# Altium project gpr.PrjPCB
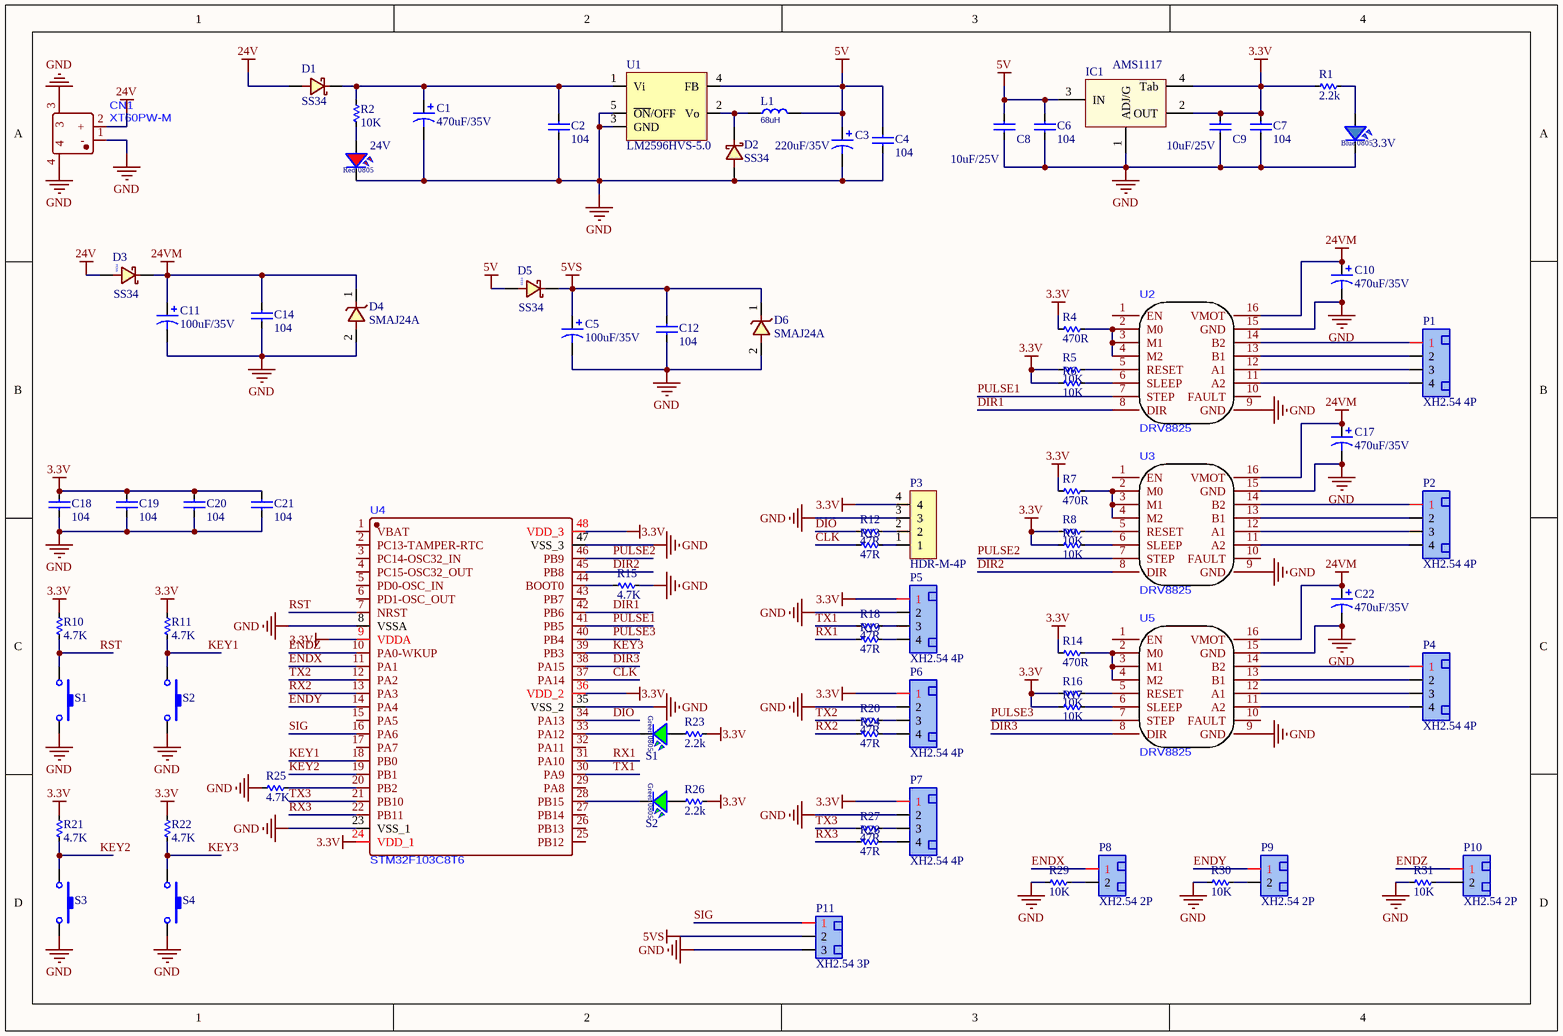
[diagram p0: schematic.SchDoc]
1 sheet, 82 parts. Net scope: global (net labels, ports and power ports of the same name join across sheets).
Board file: pcb.PcbDoc

## Sheet schematic.SchDoc: <Project Name>
size A4; ENG_APP_DATE: --/--/--; DSN_APP_DATE: --/--/--; CHK_APP_DATE: --/--/--; Engineer: Engineer; Address4: Thành phố Hồ Chí Minh; DocumentNumber: 1; Revision: 1.0; SheetNumber: 1; SheetTotal: 1

### Parts
(Parts that share a designator on the sheet are numbered #1, #2 ... from top to bottom, then left to right.)
3.3V  LED BLUE  [LED 0805 Blue]  (value not drawn)
24V  LED RED  [LED 0805 Red]  (value not drawn)
C1  470uF/35V  [C8X12mm]
C2  104  [C_0805_SMD]
C3  220uF/35V  [C8X12mm]
C4  104  [C_0805_SMD]
C5  100uF/35V  [C_6.3x12]
C6  104  [C_0805_SMD]
C7  104  [C_0805_SMD]
C8  10uF/25V  [C_0805_SMD]
C9  10uF/25V  [C_0805_SMD]
C10  470uF/35V  [C8X12mm]
C11  100uF/35V  [C_6.3x12]
C12  104  [C_0805_SMD]
C14  104  [C_0805_SMD]
C17  470uF/35V  [C8X12mm]
C18  104  [C_0805_SMD]
C19  104  [C_0805_SMD]
C20  104  [C_0805_SMD]
C21  104  [C_0805_SMD]
C22  470uF/35V  [C8X12mm]
CN1  XT60PW-M  [CONN-TH_XT60PW-M]
D1  SS34  [D_SMA]
D2  SS34  [D_SMA]
D3  SS34  [D_SMA]
D4  SMAJ24A  [DO_241AC_SMA_MFG]
D5  SS34  [D_SMA]
D6  SMAJ24A  [DO_241AC_SMA_MFG]
IC1  AMS1117  [SOT223-4N]
L1  68uH  [CDRH127]
P1  XH2.54 4P  [XH2.54_4P_RA]
P2  XH2.54 4P  [XH2.54_4P_RA]
P3  HDR-M-4P  [HDR_M_1X4]
P4  XH2.54 4P  [XH2.54_4P_RA]
P5  XH2.54 4P  [XH2.54_4P_RA]
P6  XH2.54 4P  [XH2.54_4P_RA]
P7  XH2.54 4P  [XH2.54_4P_RA]
P8  XH2.54 2P  [XH2.54_2P_RA]
P9  XH2.54 2P  [XH2.54_2P_RA]
P10  XH2.54 2P  [XH2.54_2P_RA]
P11  XH2.54 3P  [XH2.54_3P_RA]
R1  2.2k  [RES-SMD-0805]
R2  10K  [RES-SMD-0805]
R4  470R  [RES-SMD-0805]
R5  10K  [RES-SMD-0805]
R6  10K  [RES-SMD-0805]
R7  470R  [RES-SMD-0805]
R8  10K  [RES-SMD-0805]
R9  10K  [RES-SMD-0805]
R10  4.7K  [RES-SMD-0805]
R11  4.7K  [RES-SMD-0805]
R12  47R  [RES-SMD-0805]
R13  47R  [RES-SMD-0805]
R14  470R  [RES-SMD-0805]
R15  4.7K  [RES-SMD-0805]
R16  10K  [RES-SMD-0805]
R17  10K  [RES-SMD-0805]
R18  47R  [RES-SMD-0805]
R19  47R  [RES-SMD-0805]
R20  47R  [RES-SMD-0805]
R21  4.7K  [RES-SMD-0805]
R22  4.7K  [RES-SMD-0805]
R23  2.2k  [RES-SMD-0805]
R24  47R  [RES-SMD-0805]
R25  4.7K  [RES-SMD-0805]
R26  2.2k  [RES-SMD-0805]
R27  47R  [RES-SMD-0805]
R28  47R  [RES-SMD-0805]
R29  10K  [RES-SMD-0805]
R30  10K  [RES-SMD-0805]
R31  10K  [RES-SMD-0805]
S1#1  SW-SMD  [SW-SMD 3x6 mm]  (value not drawn)
S1#2  LED GREEN  [LED 0805 Green]  (value not drawn)
S2#1  SW-SMD  [SW-SMD 3x6 mm]  (value not drawn)
S2#2  LED GREEN  [LED 0805 Green]  (value not drawn)
S3  SW-SMD  [SW-SMD 3x6 mm]  (value not drawn)
S4  SW-SMD  [SW-SMD 3x6 mm]  (value not drawn)
U1  LM2596HVS-5.0  [TO-263-5]
U2  DRV8825  [DRV8825]
U3  DRV8825  [DRV8825]
U4  STM32F103C8T6  [LQFP-48_L7.0-W7.0-P0.50-LS9.0-BL]
U5  DRV8825  [DRV8825]

### Nets
3.3V: C7.2 C9.2 C18.2 C19.2 C20.2 C21.2 IC1.2(OUT) IC1.4(Tab) P3.4 P5.1 P6.1 P7.1 R1.2 R4.2 R5.2 R6.2 R7.2 R8.2 R9.2 R10.1 R11.1 R14.2 R16.2 R17.2 R21.1 R22.1 R23.1 R26.1 U4.9(VDDA) U4.24(VDD_1) U4.36(VDD_2) U4.48(VDD_3)
5V: C3.1 C4.2 C6.2 C8.2 D5.1(A) IC1.3(IN) L1.2 U1.4(FB)
5VS: C5.1 C12.1 D5.2(K) D6.1 P11.2
24V: CN1.2(+) D1.1(A) D3.1(A)
24VM: C10.1 C11.1 C14.1 C17.1 C22.1 D3.2(K) D4.1 U2.16(VMOT) U3.16(VMOT) U5.16(VMOT)
GND: 3.3V.2 24V.2 C1.2 C2.1 C3.2 C4.1 C5.2 C6.1 C7.1 C8.1 C9.1 C10.2 C11.2 C12.2 C14.2 C17.2 C18.1 C19.1 C20.1 C21.1 C22.2 CN1.1(-) CN1.3 CN1.4 D2.1(A) D4.2 D6.2 IC1.1(ADJ/G) P3.3 P5.2 P6.2 P7.2 P11.3 R15.1 R25.1 R29.2 R30.2 R31.2 S1#1.2 S2#1.2 S3.2 S4.2 U1.3(GND) U1.5(~{ON}/OFF) U2.9(GND) U2.15(GND) U3.9(GND) U3.15(GND) U4.8(VSSA) U4.23(VSS_1) U4.35(VSS_2) U4.47(VSS_3) U5.9(GND) U5.15(GND)
CLK: R13.2 U4.37(PA14)
DIO: R12.2 U4.34(PA13)
DIR1: U2.8(DIR) U4.42(PB6)
DIR2: U3.8(DIR) U4.45(PB8)
DIR3: U4.38(PA15) U5.8(DIR)
ENDX: P8.1 U4.11(PA1)
ENDY: P9.1 U4.14(PA4)
ENDZ: P10.1 U4.10(PA0-WKUP)
KEY1: R11.2 S2#1.1 U4.18(PB0)
KEY2: R21.2 S3.1 U4.19(PB1)
KEY3: R22.2 S4.1 U4.39(PB3)
PULSE1: U2.7(STEP) U4.41(PB5)
PULSE2: U3.7(STEP) U4.46(PB9)
PULSE3: U4.40(PB4) U5.7(STEP)
RST: R10.2 S1#1.1 U4.7(NRST)
RX1: R19.2 U4.31(PA10)
RX2: R24.2 U4.13(PA3)
RX3: R28.2 U4.22(PB11)
SIG: P11.1 U4.16(PA6)
TX1: R18.2 U4.30(PA9)
TX2: R20.2 U4.12(PA2)
TX3: R27.2 U4.21(PB10)
Net3.3V_1: 3.3V.1 R1.1
Net24V_1: 24V.1 R2.2
NetC1_1: C1.1 C2.2 D1.2(K) R2.1 U1.1(Vi)
NetD2_2: D2.2(K) L1.1 U1.2(Vo)
NetP1_1: P1.1 U2.14(B2)
NetP1_2: P1.2 U2.13(B1)
NetP1_3: P1.3 U2.12(A1)
NetP1_4: P1.4 U2.11(A2)
NetP2_1: P2.1 U3.14(B2)
NetP2_2: P2.2 U3.13(B1)
NetP2_3: P2.3 U3.12(A1)
NetP2_4: P2.4 U3.11(A2)
NetP3_1: P3.1 R13.1
NetP3_2: P3.2 R12.1
NetP4_1: P4.1 U5.14(B2)
NetP4_2: P4.2 U5.13(B1)
NetP4_3: P4.3 U5.12(A1)
NetP4_4: P4.4 U5.11(A2)
NetP5_3: P5.3 R18.1
NetP5_4: P5.4 R19.1
NetP6_3: P6.3 R20.1
NetP6_4: P6.4 R24.1
NetP7_3: P7.3 R27.1
NetP7_4: P7.4 R28.1
NetP8_2: P8.2 R29.1
NetP9_2: P9.2 R30.1
NetP10_2: P10.2 R31.1
NetR4_1: R4.1 U2.2(M0) U2.3(M1) U2.4(M2)
NetR5_1: R5.1 U2.5(RESET)
NetR6_1: R6.1 U2.6(SLEEP)
NetR7_1: R7.1 U3.2(M0) U3.3(M1) U3.4(M2)
NetR8_1: R8.1 U3.5(RESET)
NetR9_1: R9.1 U3.6(SLEEP)
NetR14_1: R14.1 U5.2(M0) U5.3(M1) U5.4(M2)
NetR15_2: R15.2 U4.44(BOOT0)
NetR16_1: R16.1 U5.5(RESET)
NetR17_1: R17.1 U5.6(SLEEP)
NetR23_2: R23.2 S1#2.1
NetR25_2: R25.2 U4.20(PB2)
NetR26_2: R26.2 S2#2.1
NetS1#2_2: S1#2.2 U4.33(PA12)
NetS2#2_2: S2#2.2 U4.28(PB15)

Not connected (* = marked no-connect by the designer): U2 1(EN) 10(FAULT); U3 1(EN) 10(FAULT); U4 1(VBAT) 2(PC13-TAMPER-RTC) 3(PC14-OSC32_IN) 4(PC15-OSC32_OUT) 5(PD0-OSC_IN) 6(PD1-OSC_OUT) 15(PA5) 17(PA7) 25(PB12) 26(PB13) 27(PB14) 29(PA8) 32(PA11) 43(PB7); U5 1(EN) 10(FAULT)

### Notes on the sheet
- Title
- Size:
- Date:
- A4
- Number:
- Time:
- Revision:
- Sheet
- of
- File:
- (in symbol LED 0805 BLUE) Blue; 0805
- (in symbol LED 0805 GREEN) Green; 0805
- (in symbol LED 0805 RED) Red; 0805

### Library data of the parts
3.3V = LED 0805 BLUE: LED 0805 SMD BLUE; Code: 8600-019; Designed by: TranLuyen
24V = LED 0805 RED: LED 0805 SMD RED; Code: 8600-017; Designed by: TranLuyen
C1 C10 C17 C22 = Cap Pol 470uF/35V: Polarized Capacitor (Axial) 470uF 35V; Code: 1402-231
C2 C4 C6 C7 C12 C14 C18-C21 = Cap 0805 104 100nF: Cap SMD 0805 104-100nF-0.1uF 50V; Code: 1438-080
C3 = Cap Pol 220uF/35V: Polarized Capacitor (Axial) 220uF 35V; Code: 1402-228
C5 C11 = Cap Pol 100uF/35V: Polarized Capacitor (Axial) 100uF 35V; Code: 1402-225
C8 C9 = Cap 0805 10uF 25V: Cap SMD 0805 10uF; Code: 1436-100
D1-D3 D5 = SS34-SMA: Surface-Mount Schottky Barrier Rectifier; Code: 2005-008
  D3 D5: Value: SS34
D4 D6 = TVS SMAJ24A-DO241AC: SMAJ Series 400W Surface Mount Uni-Directional TVS Diode - DO-214AC; Designed by: TranLuyen; Code: N/A
IC1 = AMS1117-3.3V SOT223: SOT-223; Code: 5102-034
L1 = IND CDRH127 1280-680 68uH: CDRH127 Cuộn Cảm Dán SMD 1280-680 68uH 3.2A; Code: 1522-003
P1 P2 P4-P7 = XH2.54_4P_RA: XH2.54 RA; Code: 3509-012
P3 = HDR 2.54 M 4 Pin: HDR 2.54 MALE; Code: 3504-028 * 0.1
P8-P10 = XH2.54_2P_RA: XH2.54 RA; Code: 3509-010
P11 = XH2.54_3P_RA: XH2.54 RA; Code: 3509-011; Designed by: Nhox
R1 R23 R26 = Res 2.2K 0805: Resistor SMD 0805; Code: 1024-094
R2 R5 R6 R8 R9 R16 R17 R29-R31 = Res 10k 0805: Resistor SMD 0805; Code: 1024-111
R4 R7 R14 = Res 470R 0805: Resistor SMD 0805; Code: 1024-078; Value: 470R
R10 R11 R15 R21 R22 R25 = Res 4.7k 0805: Resistor SMD 0805; Code: 1024-103
R12 R13 R18-R20 R24 R27 R28 = Res 47R 0805: Resistor SMD 0805; Designed by: Nhox; Code: N/A
S1#1 S2#1 S3 S4 = SW2 SMD 3x6: Button 3x6 mm x 2.5mm 2Pin SMD; Code: 3606-006
S1#2 S2#2 = LED 0805 GREEN: LED 0805 SMD GREEN; Code: 8600-027; Designed by: TranLuyen
U1 = LM2596HVS-5.0: Vin 4.5-40VDC, Vout 5VDC, Iout MAX 3A; Code: 5101-052